# Altium schematic sheet Eload Gen 3 Power Module - Input Rev 2.SchDoc
size A
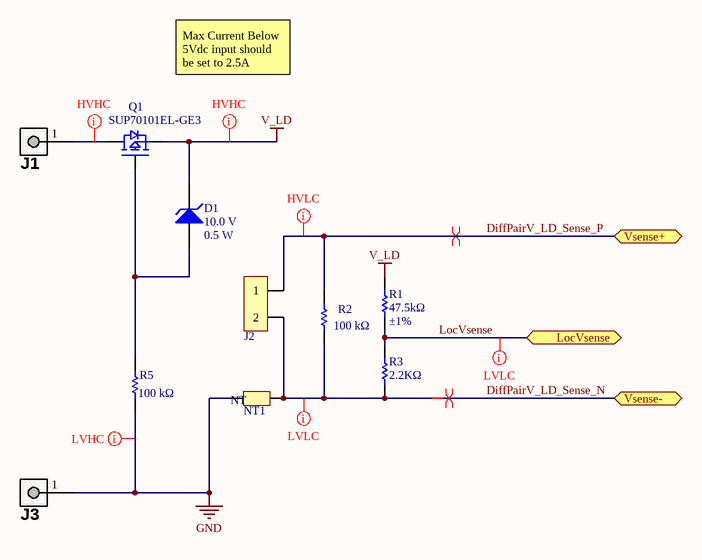
[diagram p0: Eload Gen 3 Power Module - Input Rev 2.SchDoc]

## Parts
D1  Breakdown Voltage: 10.0 V  Power Rating: 0.5 W  [SOD123]  (hidden comment: MMSZ5240BT1G)
J1  wire teminal, lugs, screw, Keystone 8197  [Keystone 8197]  (value not drawn)
J2  TE Connectivity 282836-2  [TERM BLOCK 2POS SIDE ENTRY 5MM]  (value not drawn)
J3  wire teminal, lugs, screw, Keystone 8197  [Keystone 8197]  (value not drawn)
NT1  Net Tie,0.254mm  [0.254mm Net Tie]  (value not drawn)  (net tie, no BOM)
Q1  SUP70101EL-GE3  [TO-220 RA]
R1  Resistance: 47.5kΩ  Tolerance: ±1%  [res, 0805, HD]  (hidden comment: RK73H2ATTD4752F)
R2  Resistance: 100 kΩ  [res, 0805, HD]  (hidden comment: CRCW0805100KFKEA)
R3  Resistance: 2.2KΩ  [res, 0805, HD]  (hidden comment: CRCW08052K20FKEA)
R5  Resistance: 100 kΩ  [res, 0805, HD]  (hidden comment: CRCW0805100KFKEA)

## Ports
LocVsense, Vsense+, Vsense-

## Nets
GND: J3.1 NT1.1 R5.1
V_LD: D1.1(K) Q1.3(Source) R1.2
DiffPairV_LD_Sense_N: J2.2 NT1.2 R2.1 R3.1 ; port Vsense-
DiffPairV_LD_Sense_P: J2.1 R2.2 ; port Vsense+
LocVsense: R1.1 R3.2 ; port LocVsense
NetD1_2: D1.2(A) Q1.1(Gate) R5.2
NetJ1_1: J1.1 Q1.2(Drain)

## Layout directives
net class Low Volt; net class Low Current; net class PwrRail: DiffPairV_LD_Sense_N, LocVsense
net class High Volt; net class High Current: NetJ1_1, V_LD
net class Low Volt; net class High Current: GND
differential pair: DiffPairV_LD_Sense_N, DiffPairV_LD_Sense_P
net class High Volt; net class Low Current: DiffPairV_LD_Sense_P

## Notes on the sheet
- Max Current Below 5Vdc input should be set to 2.5A
- (in symbol Net Tie,0.254mm) NT

## Library data of the parts
D1 = Diode, Zener,SOD-123,10V,500mW, MMSZ5240BT1G: Zener Voltage Regulator, 500 mW, 2-Pin SOD-123, Pb-Free, Tape and Reel; Lead-Free Status: Lead Free; Material: Plastic; Case/Package: SOD-123; Lifecycle Status: Active; Mounting Style: Surface Mount; Number of Pins: 2; REACH SVHC Compliance: No SVHC; RoHS: Compliant; Voltage Rating (DC): 10.0 V; Supplier 1: Digi-Key; Supplier Part Number 1: MMSZ5240BT1GOSCT-ND; Supplier 2: LCSC; Supplier Part Number 2: C82084
J1 J3 = wire teminal, lugs, screw, Keystone 8197: WRIGHT TOOL 8197 Socket, 1 In Dr, 3-1/8 In, 12 Pt, Std. More details: Socket, Drive Size 1 In., Number of Points 12, ...; Manufacturer Part Number: 8197; Current Rating: 30.0 A; Pin Pitch: 0.0020066 m; Lead-Free Status: Lead Free; Number of Contacts: 6; Gender: Male; REACH SVHC Compliance: No SVHC; Orientation: Straight; Contact Material: Brass; Size-Height: 0.011684 m; Contact Plating: Tin; Number of Rows: 2; RoHS: Compliant; Mounting Style: Snap-In, PCB; Termination Style: Screw; Supplier 1: Digi-Key; Supplier Part Number 1: 36-8197-ND; Supplier 2: Digi-Key; Supplier Part Number 2: 36-8197-2-ND; Supplier 3: Digi-Key; Supplier Part Number 3: 36-8197-3-ND; Supplier 4: LCSC; Supplier Part Number 4: C238177
J2 = TERM BLOCK 2POS SIDE ENTRY 5MM, 282836-2: Wire to Board 2 Position 5 mm Pitch 30-16 AWG Euro Style Terminal Block; Voltage Rating (AC): 250.0 V; ELV Compliant: Compliant; Current Rating: 13.5 A; Number of Contacts: 2; Pin Pitch: 0.005 m; Lead-Free Status: Lead Free; Wire Gauge: 15.0 AWG; RoHS: Compliant; Contact Material: Brass; Contact Plating: Tin; Color: Green; Manufacturer Part Number: 282836-2; Flammability Rating: UL 94 V-0; Mounting Style: PCB; Housing Material: Nylon 6/6; Insulation Material: Nylon; Housing Color: Green; Orientation: Right Angle; Lifecycle Status: Active; REACH SVHC Compliance: No SVHC; Number of Positions: 2; Supplier 1: TME; Supplier 2: Newark; Supplier 3: Digi-Key; Supplier 4: Digi-Key; Supplier Part Number 4: A98076-ND
Q1 = MOSFET,P-Chan,100V,120A,TO220, SUP70101EL-GE3: MOSFET P-CH 100V 120A TO220AB; Manufacturer: Vishay Siliconix; mfg P/N: SQM50P08-25L_GE3; Detailed Description: P-Channel 100V 120A (Tc) 375W (Tc) Through Hole TO-220AB; Categories: Discrete Semiconductor Products; Current - Continuous Drain (Id) @ 25°C: 120A (Tc); Drive Voltage (Max Rds On, Min Rds On): 4.5V, 10V; Rds On (Max) @ Id, Vgs: 10mOhm; Gate Charge (Qg) (Max) @ Vgs: 190nC @ 10V; Vgs (Max): ±20V; Input Capacitance: 7000pF @ 50V; Power Dissipation (Max): 375W (Tc); Vgs(th) (Max) @ Id: 2.5V @ 250µA; FET Type: P-Channel; Series: Automotive, AEC-Q101, TrenchFET®; Part Status: Active; Technology: MOSFET (Metal Oxide); Drain to Source Voltage (Vdss): 100V; Operating Temperature: -55°C ~ 175°C (TJ); Mounting Type: Through Hole; Supplier Device Package: TO-220AB; Package / Case: TO-220-3; Supplier 1: Digi-Key; Supplier Part Number 1: SUP70101EL-GE3-ND
R1 = Res,0805,47.5KΩ,1%,100ppm,RK73H2ATTD4752F: 47.5 kOhms ±1% 0.25W, 1/4W Chip Resistor 0805 (2012 Metric) Automotive AEC-Q200, Moisture Resistant Thick Film; Manufacturer: KOA Speer Electronics, Inc.; Temperature Coefficient: ±100ppm/°C; Detailed Description: 47.5 kOhms ±1% 0.25W, 1/4W Chip Resistor 0805 (2012 Metric) Automotive AEC-Q200, Moisture Resistant Thick Film; mfg P/N: RK73H2ATTD4752F; Power (Watts): 0.25W, 1/4W; Composition: Thick Film; Features: Automotive AEC-Q200, Moisture Resistant; Operating Temperature: -55°C ~ 155°C; Package / Case 0805: (2012 Metric); Supplier Device Package: 0805; Size / Dimension: 0.079" L x 0.049" W (2.00mm x 1.25mm); Height - Seated (Max): 0.024" (0.60mm); Number of Terminations: 2; Supplier 1: Digi-Key; Supplier Part Number 1: 2019-RK73H2ATTD4752FCT-ND
R2 R5 = Res,0805,100kΩ,1%,100ppm,CRCW0805100KFKEA: 100 kOhms ±1% 0.125W, 1/8W Chip Resistor 0805 (2012 Metric) Thick Film; Manufacturer: Vishay; Lead-Free Status: Lead Free; Case/Package (SI): 2012; Power Rating: 125 mW; Temperature Coefficient: -100 ppm/°C to 100 ppm/°C; Resistance Tolerance: ±1%; RoHS: Compliant; Manufacturer Part Number: CRCW0805100KFKEA; Number of Pins: 2; Size-Length: 2.00 mm; Packaging: Tape & Reel (TR), Reel, Cut Tape (CT); Size-Height: 450 µm; Case/Package: 0805; Size-Width: 1.25 mm; Operating Temperature: 150 °C (max); Supplier 1 Part Number: 679-0803; Supplier 1: RS; Supplier 2: Digi-Key; Supplier Part Number 2: 541-100KCCT-ND
R3 = Res,0805,2.2KΩ,±1%,100.0 ppm/°C,150.0 V,CRCW08052K20FKEA: RES SMD 2.2K OHM 1% 1/8W 0805; Case/Package (SI): 2012; Lead-Free Status: Lead Free; Power Rating: 0.125 W; Voltage Rating (DC): 150.0 V; Case/Package: 0805; Mounting Style: Surface Mount; Number of Pins: 2; REACH SVHC Compliance: No SVHC; Resistance Tolerance: ±1%; RoHS: Compliant; Size-Height: 0.00045 m; Size-Length: 0.002 m; Size-Width: 0.00125 m; Temperature Coefficient: 100.0 ppm/°C; mfg P/N: CRCW08052K20FKEA; Supplier 1: Digi-Key; Supplier Part Number 1: 541-2.20KCCT-ND